# EAGLE schematic lt1241-bare (EAGLE 7.7.0)
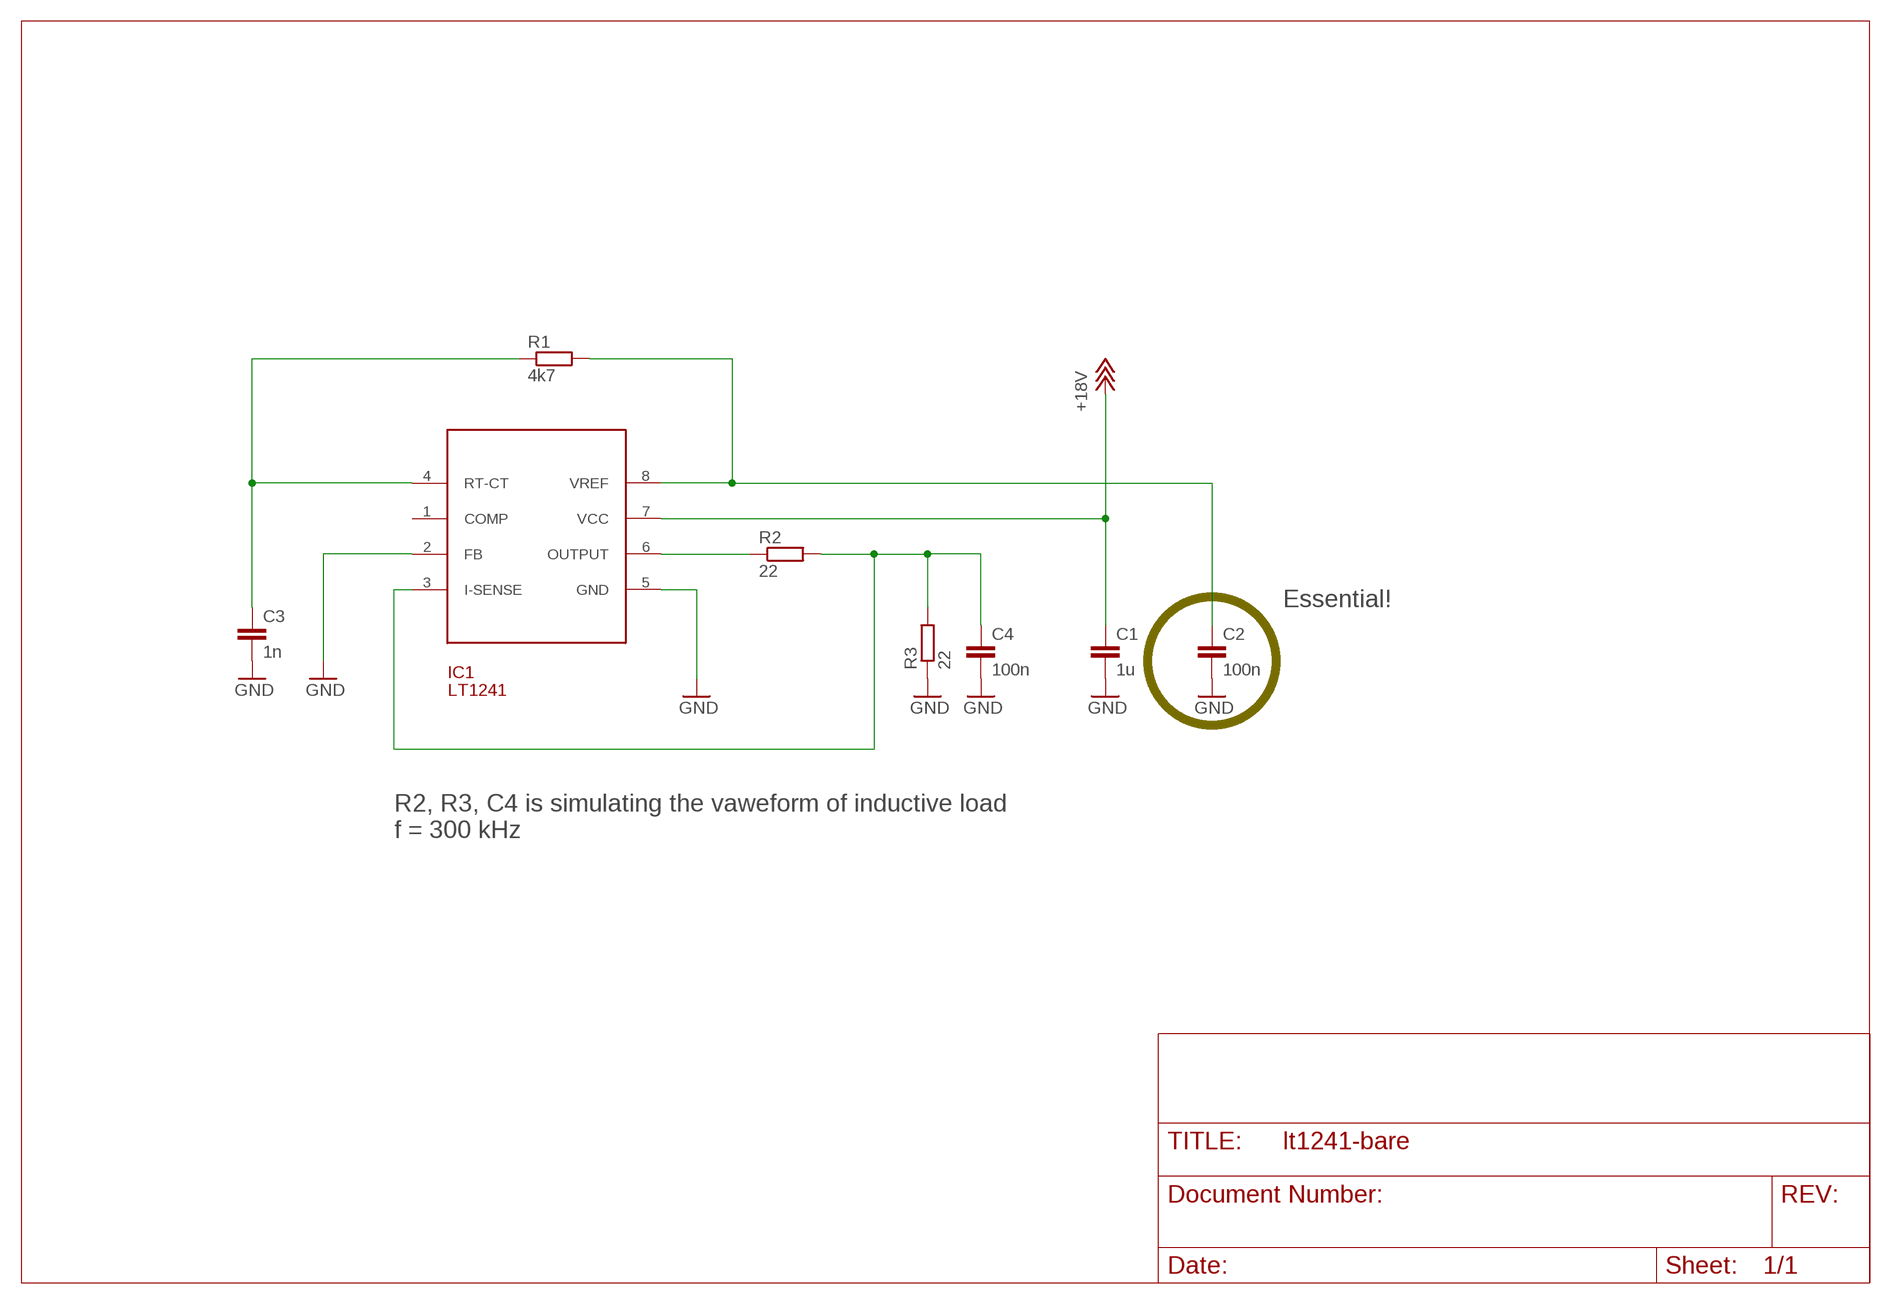
[diagram p0: schematic, sheet 1]

## Parts
C1  1u  C-EUC0805  [C0805]
C2  100n  C-EUC0805  [C0805]
C3  1n  C-EUC0805  [C0805]
C4  100n  C-EUC0805  [C0805]
IC1  LT1241  LT124X  [S8]
R1  4k7  R-EU_R0805  [R0805]
R2  22  R-EU_R0805  [R0805]
R3  22  R-EU_R0805  [R0805]

## Nets
+18V: C1.1 IC1.7(VCC)
GND: C1.2 C2.2 C3.2 C4.2 IC1.2(FB) IC1.5(GND) R3.1
N$1: C3.1 IC1.4(RT-CT) R1.1
N$2: C2.1 IC1.8(VREF) R1.2
N$3: IC1.6(OUTPUT) R2.1
N$4: C4.1 IC1.3(I-SENSE) R2.2 R3.2
Unconnected: IC1.1(COMP)

## Notes on the sheet
- Essential!
- R2, R3, C4 is simulating the vaweform of inductive load
  f = 300 kHz

## Library data of the parts
C1-C4 = rcl:C-EU: CAPACITOR, European symbol
IC1 = linear-technology:LT124X; LT124X: LT1241
R1-R3 = rcl:R-EU_: RESISTOR, European symbol